# Altium project 231006.PrjPcb
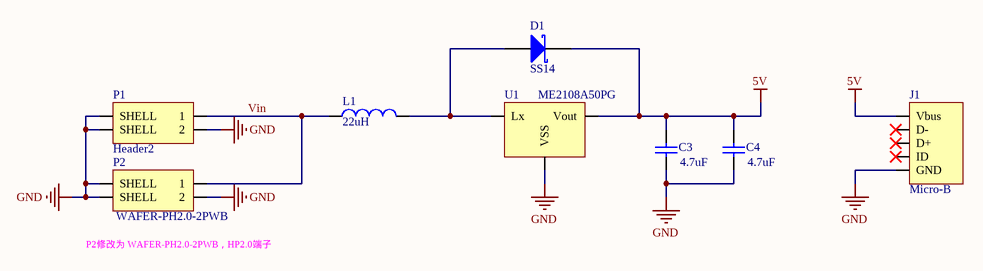
[diagram p0: 231006.SchDoc]
1 sheet, 8 parts. Net scope: global (net labels, ports and power ports of the same name join across sheets).
Board file: 231006.pcbdoc

## Sheet 231006.SchDoc
size A4; SheetNumber: 1; SheetTotal: 1

### Parts
C3  4.7uF  [1206]
C4  4.7uF  [1206]
D1  SS14  [SOD_234]
J1  Micro-B  [USB-MICRO_A]
L1  22uH  [L_4.5X6]
P1  Header2  [mh1.25-2P]
P2  WAFER-PH2.0-2PWB  [CONN-SMD_2P-P2.00_XUNPU_WAFER-PH2.0-2PWB]
U1  ME2108A50PG  [SOT89]

### Nets
5V: C3.2 C4.2 D1.1(K) J1.1(Vbus) U1.2(Vout)
GND: C3.1 C4.1 J1.5(GND) P1.0(SHELL) P1.2 P2.0(SHELL) P2.2 U1.1(VSS)
Vin: L1.1 P1.1 P2.1
NetD1_2: D1.2(A) L1.2 U1.3(Lx)

Not connected (* = marked no-connect by the designer): J1 2(D-)* 3(D+)* 4(ID)*

### Notes on the sheet
- (near P2) P2修改为 WAFER-PH2.0-2PWB，HP2.0端子

### Library data of the parts
C3 C4 = Cap: Capacitor; Published: 8-Jun-2000; LatestRevisionDate: 17-Jul-2002; LatestRevisionNote: Re-released for DXP Platform.; PackageReference: RAD-0.3; Publisher: Altium Limited; PackageDescription: Radial Cap, Thru-Hole; 2 Leads; 0.3 in Pin Spacing; Value: 4.7uF
D1 = Diode 10TQ035: Schottky Rectifier; Note: Terminal 2 is the TAB and is electrically connected to the cathode; Published: 8-Jun-2000; LatestRevisionDate: 17-Jul-2002; LatestRevisionNote: Re-released for DXP Platform.; DatasheetVersion: PD-2.057B; PackageVersion: Feb-1998; PackageReference: TO-220AC; Publisher: Altium Limited; PackageDescription: TO, Thru-Hole, Vertical, Heatsink Mounted; 3 In-Line Leads (1 Absent); Pitch 2.54 mm; ComponentLink1Description: Manufacturer Link; ComponentLink1URL: http://www.irf.com/; ComponentLink2Description: Datasheet; ComponentLink2URL: http://www.irf.com/product-info/datasheets/data/10tq.pdf
L1 = Inductor: Code_IEC: 1005; Published: 8-Jun-2000; LatestRevisionDate: 29-May-2009; LatestRevisionNote: IPC-7351 Footprint Added.; PackageReference: 0402-A; Publisher: Altium Limited; PackageDescription: Chip Inductor; Code_JEITA: 0402; Value: 22uH
P2 = Header2